# Altium project ADL5511.PrjPcb
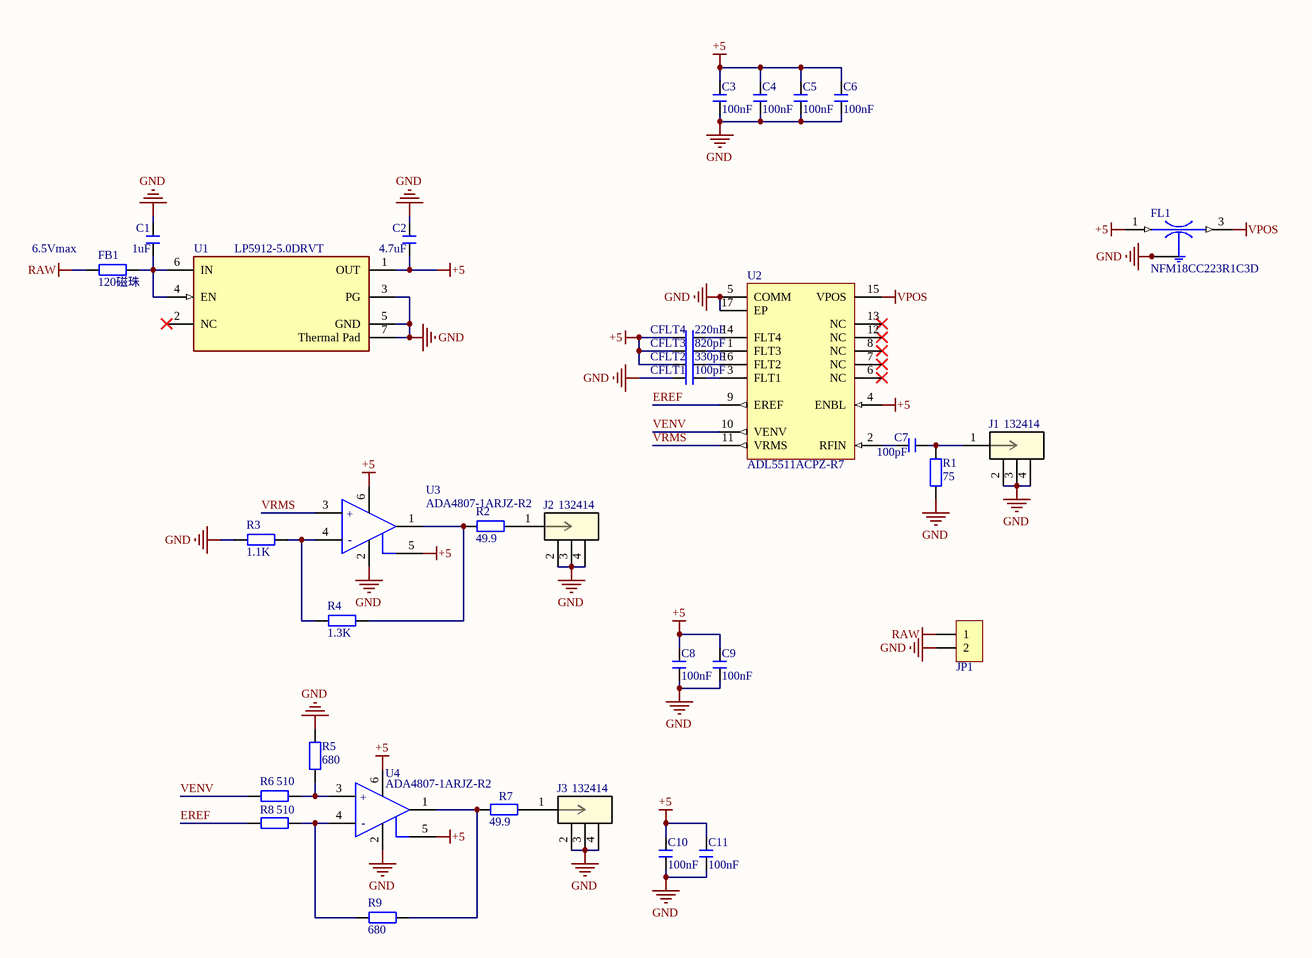
[diagram p0: ADL5511.SchDoc]
1 sheet, 34 parts. Net scope: global (net labels, ports and power ports of the same name join across sheets).
Board file: ADL5511.PcbDoc

## Sheet ADL5511.SchDoc
size A2; SheetNumber: 1; SheetTotal: 1

### Parts
C1  1uF  [C 0603_L]
C2  4.7uF  [C 0603_L]
C3  100nF  [C 0402_L]
C4  100nF  [C 0402_L]
C5  100nF  [C 0402_L]
C6  100nF  [C 0402_L]
C7  100pF  [C 0402_L]
C8  100nF  [C 0402_L]
C9  100nF  [C 0402_L]
C10  100nF  [C 0402_L]
C11  100nF  [C 0402_L]
CFLT1  100pF  [C 0402_L]
CFLT2  330pF  [C 0402_L]
CFLT3  820pF  [C 0402_L]
CFLT4  220nF  [C 0402_L]
FB1  120磁珠  [R 0603_L]
FL1  NFM18CC223R1C3D  [FIL_NFM18CC223R1C3D]
J1  132414  [CONN_132414_AMP]
J2  132414  [CONN_132414_AMP]
J3  132414  [CONN_132414_AMP]
JP1  HDR-1X2  [KF2510-LI-2P]  (value not drawn)
R1  75  [R 0402_L]
R2  49.9  [R 0402_L]
R3  1.1K  [R 0402_L]
R4  1.3K  [R 0402_L]
R5  680  [R 0402_L]
R6  510  [R 0402_L]
R7  49.9  [R 0402_L]
R8  510  [R 0402_L]
R9  680  [R 0402_L]
U1  LP5912-5.0DRVT  [FP-DRV0006A-IPC_C]
U2  ADL5511ACPZ-R7  [ADI-CP-16-22_N]
U3  ADA4807-1ARJZ-R2  [FP-RJ-6-IPC_C]
U4  ADA4807-1ARJZ-R2  [FP-RJ-6-IPC_C]

### Nets
+5: C2.1 C3.2 C4.2 C5.2 C6.2 C8.2 C9.2 C10.2 C11.2 CFLT2.1 CFLT3.1 CFLT4.1 FL1.1(IN) U1.1(OUT) U2.4(ENBL) U3.5(~{DISABLE}) U3.6(+VS) U4.5(~{DISABLE}) U4.6(+VS)
GND: C1.2 C2.2 C3.1 C4.1 C5.1 C6.1 C8.1 C9.1 C10.1 C11.1 CFLT1.1 FL1.2(GND) FL1.2_1(GND) J1.2 J1.3 J1.4 J2.2 J2.3 J2.4 J3.2 J3.3 J3.4 JP1.2 R1.1 R3.1 R5.1 U1.3(PG) U1.5(GND) U1.7(Thermal_Pad) U2.5(COMM) U2.17(EP) U3.2(-VS) U4.2(-VS)
RAW: FB1.1 JP1.1
VPOS: FL1.3(OUT) U2.15(VPOS)
EREF: R8.1 U2.9(EREF)
VENV: R6.1 U2.10(VENV)
VRMS: U2.11(VRMS) U3.3(+IN)
NetC1_1: C1.1 FB1.2 U1.4(EN) U1.6(IN)
NetC7_1: C7.1 U2.2(RFIN)
NetC7_2: C7.2 J1.1 R1.2
NetCFLT1_2: CFLT1.2 U2.3(FLT1)
NetCFLT2_2: CFLT2.2 U2.16(FLT2)
NetCFLT3_2: CFLT3.2 U2.1(FLT3)
NetCFLT4_2: CFLT4.2 U2.14(FLT4)
NetJ2_1: J2.1 R2.2
NetJ3_1: J3.1 R7.2
NetR2_1: R2.1 R4.2 U3.1(VOUT)
NetR3_2: R3.2 R4.1 U3.4(-IN)
NetR5_2: R5.2 R6.2 U4.3(+IN)
NetR7_1: R7.1 R9.2 U4.1(VOUT)
NetR8_2: R8.2 R9.1 U4.4(-IN)

Not connected (* = marked no-connect by the designer): U1 2(NC)*; U2 6(NC)* 7(NC)* 8(NC)* 12(NC)* 13(NC)*

### Notes on the sheet
- (near FB1) 6.5Vmax
- (in symbol CMP-09116-000179-1) +; -

### Library data of the parts
C1-C11 CFLT1-CFLT4 = C: 贴片电容; 淘宝ID: 小糖豆的小窝窝; BOM名称: 贴片电容; 下单链接: https://item.taobao.com/item.htm?ft=t&id=613637044352
FB1 R1-R9 = R: 贴片电阻; 淘宝ID: 小糖豆的小窝窝; BOM名称: 贴片电阻; 下单链接: https://item.taobao.com/item.htm?ft=t&id=613637044352
FL1 = NFM18CC223R1C3D: SMD Capacitor with Capacitance: 22000pF Tol. 20%. Rated Voltage: 16Vdc; MF: Murata; MP: NFM18CC223R1C3D; SnapEDA_Link: https://www.snapeda.com/parts/NFM18CC223R1C3D/Murata/view-part/?ref=snap; Availability: In Stock; Package: NONSTANDARD; Check_prices: https://www.snapeda.com/parts/NFM18CC223R1C3D/Murata/view-part/?ref=eda; Value: *; Purchase-URL: https://pricing.snapeda.com/search/part/NFM18CC223R1C3D/?ref=eda; Price: None
J1-J3 = 132414: No Description Available; Mfr_Name: Amphenol ICC; Copyright: Copyright (C) 2022 Ultra Librarian. All rights reserved.; Manufacturer_Part_Number: 132414; RefDes: RefDes; Type: DEV
JP1 = Header 2: 2P接插件; 淘宝ID: 小糖豆的小窝窝; BOM名称: 2P接插件; 下单链接: https://item.taobao.com/item.htm?ft=t&id=613637044352
U1 = CMP-04917-000099-1: IC REG LINEAR 5.0V 500MA 6SON; Dropout Voltage: 950mV; Quiescent Current: 30uA; Output Voltage: 3.3V; Number of Regulators: 1; Min Operating Temperature: -40°C; Number of Pins: 6; Max Operating Temperature: 125°C; RoHS Compliant: Yes; Packaging: Tape and Reel; Output Current: 500mA; Mount: Surface Mount; Lead Free: Lead Free
U2 = CMP-0284-00041-1: DC to 6 GHz Envelope and TruPwr RMS Detector, CP-16-22, Pb-Free, 54 Tube; Voltage Supply (V): 4.75 to 5.25; Product Description: Crest factor detector with rms and envelope outputs; Response Time (ns typ): 10Âµs; Output Response: Linear in Voltage; Supply Current: 21.5mA; Temp Stability (dB): 250mdB; RF Frequency (MHz): 6GHz; Dynamic Range (dB): 47dB; ComponentLink3Description: Package Specification; ComponentLink1URL: www.analog.com; PackageReference: CP-16-22; ComponentLink2Description: Datasheet; DatasheetVersion: Rev. 0; PackageDescription: 16-Lead Lead Frame Chip Scale Package [LFCSP_WQ]; ComponentLink1Description: Manufacturer URL; PackageVersion: 111808-A; Code_JEDEC: MO-220-WEED; ComponentLink3URL: http://www.analog.com/static/imported-files/packages/PKG_PDF/LFCSP(CP)/CP-16/CP_16_22.pdf; ComponentLink2URL: http://www.analog.com/static/imported-files/data_sheets/ADL5511.pdf
U3 U4 = CMP-09116-000179-1: IC OPAMP VFB 1 CIRCUIT SOT23-6; Dual Supply Voltage: 5V; Slew Rate: 225V/µs; Bandwidth: 200MHz; Operating Supply Voltage: 10V; Max Supply Voltage: 11V; Common Mode Rejection Ratio: 96dB; -3db Bandwidth: 180MHz; Output Current: 60mA; Input Bias Current: 1.2uA; Power Supply Rejection Ratio (PSRR): 105dB; Max Frequency: 100kHz; Number of Amplifiers: 1; Min Supply Voltage: 3V; Input Offset Voltage (Vos): 20uV; Voltage Gain: 130dB; Operating Supply Current: 950uA; Output Current per Channel: 106mA; Min Input Voltage: 2.7V; Max Operating Temperature: 125°C; Length: 3mm; Lead Free: Contains Lead; Contact Plating: Tin; REACH SVHC: No SVHC; Packaging: Cut Tape; Height: 1.3mm; Gain Bandwidth Product: 200MHz; Max Input Voltage: 11V; Mount: Surface Mount; Width: 1.7mm; RoHS Compliant: Yes; Number of Circuits: 1; Case/Package: SOT-23-6; Number of Pins: 6; Min Operating Temperature: -40°C